# EAGLE design shd_v1.0 (EAGLE 9.3.0)

## Sheet 1 of 2
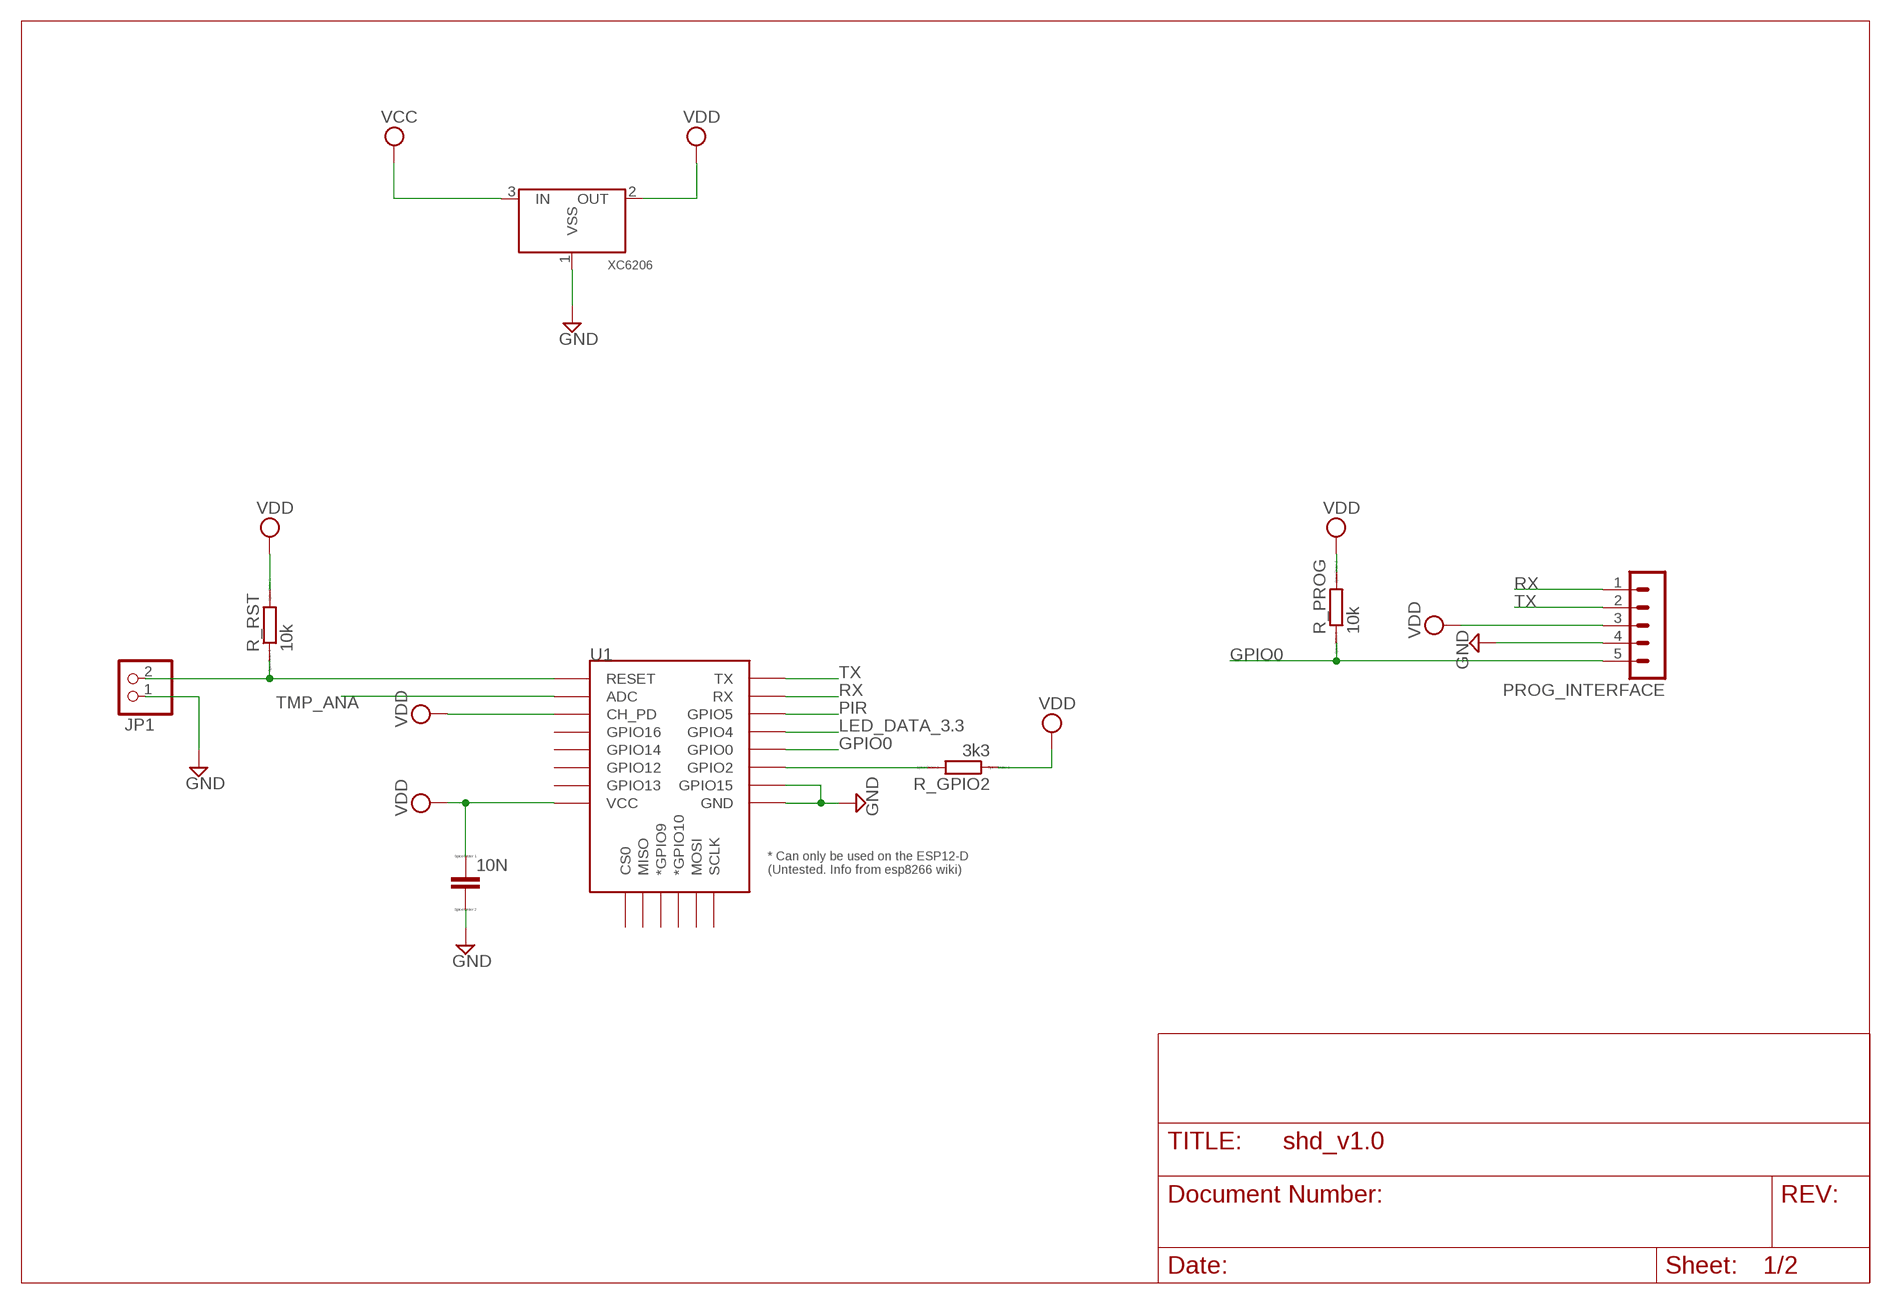
[diagram p0: schematic, sheet 1]

### Parts
10N  C  [C0805]
JP1  PINHD-1X2  [1X02]
PROG_INTERFACE  MA05-1  [MA05-1]
R_GPIO2  3k3  R0207/10  [0207/10]
R_PROG  10k  R0207/10  [0207/10]
R_RST  10k  R0207/10  [0207/10]
U1  ESP12ESMD  [ESP12E-SMD]
XC6206  XC6206  [SOT23]

### Nets
GND: 10N.2 JP1.1 PROG_INTERFACE.4 U1.GND U1.GPIO15 XC6206.1(VSS) ; also sheet 2
GPIO0: PROG_INTERFACE.5 R_PROG.1 U1.GPIO0
LED_DATA_3.3: U1.GPIO4 ; also sheet 2
N$2: R_GPIO2.2 U1.GPIO2
PIR: U1.GPIO5 ; also sheet 2
RST: JP1.2 R_RST.1 U1.RESET
RX: PROG_INTERFACE.1 U1.RXD0(RX)
TMP_ANA: U1.ADC ; also sheet 2
TX: PROG_INTERFACE.2 U1.TXD0(TX)
VCC_5.0: XC6206.3(IN) ; supply symbol labelled VCC ; also sheet 2
VDD: R_GPIO2.1
VDD_3.3: 10N.1 PROG_INTERFACE.3 R_PROG.2 R_RST.2 U1.CH_PD U1.VCC XC6206.2(OUT) ; supply symbol labelled VDD ; also sheet 2
Unconnected: U1.CS0 U1.GPIO9(*GPIO9) U1.GPIO10(*GPIO10) U1.GPIO12 U1.GPIO13 U1.GPIO14 U1.GPIO16 U1.MISO U1.MOSI U1.SCLK

## Sheet 2 of 2
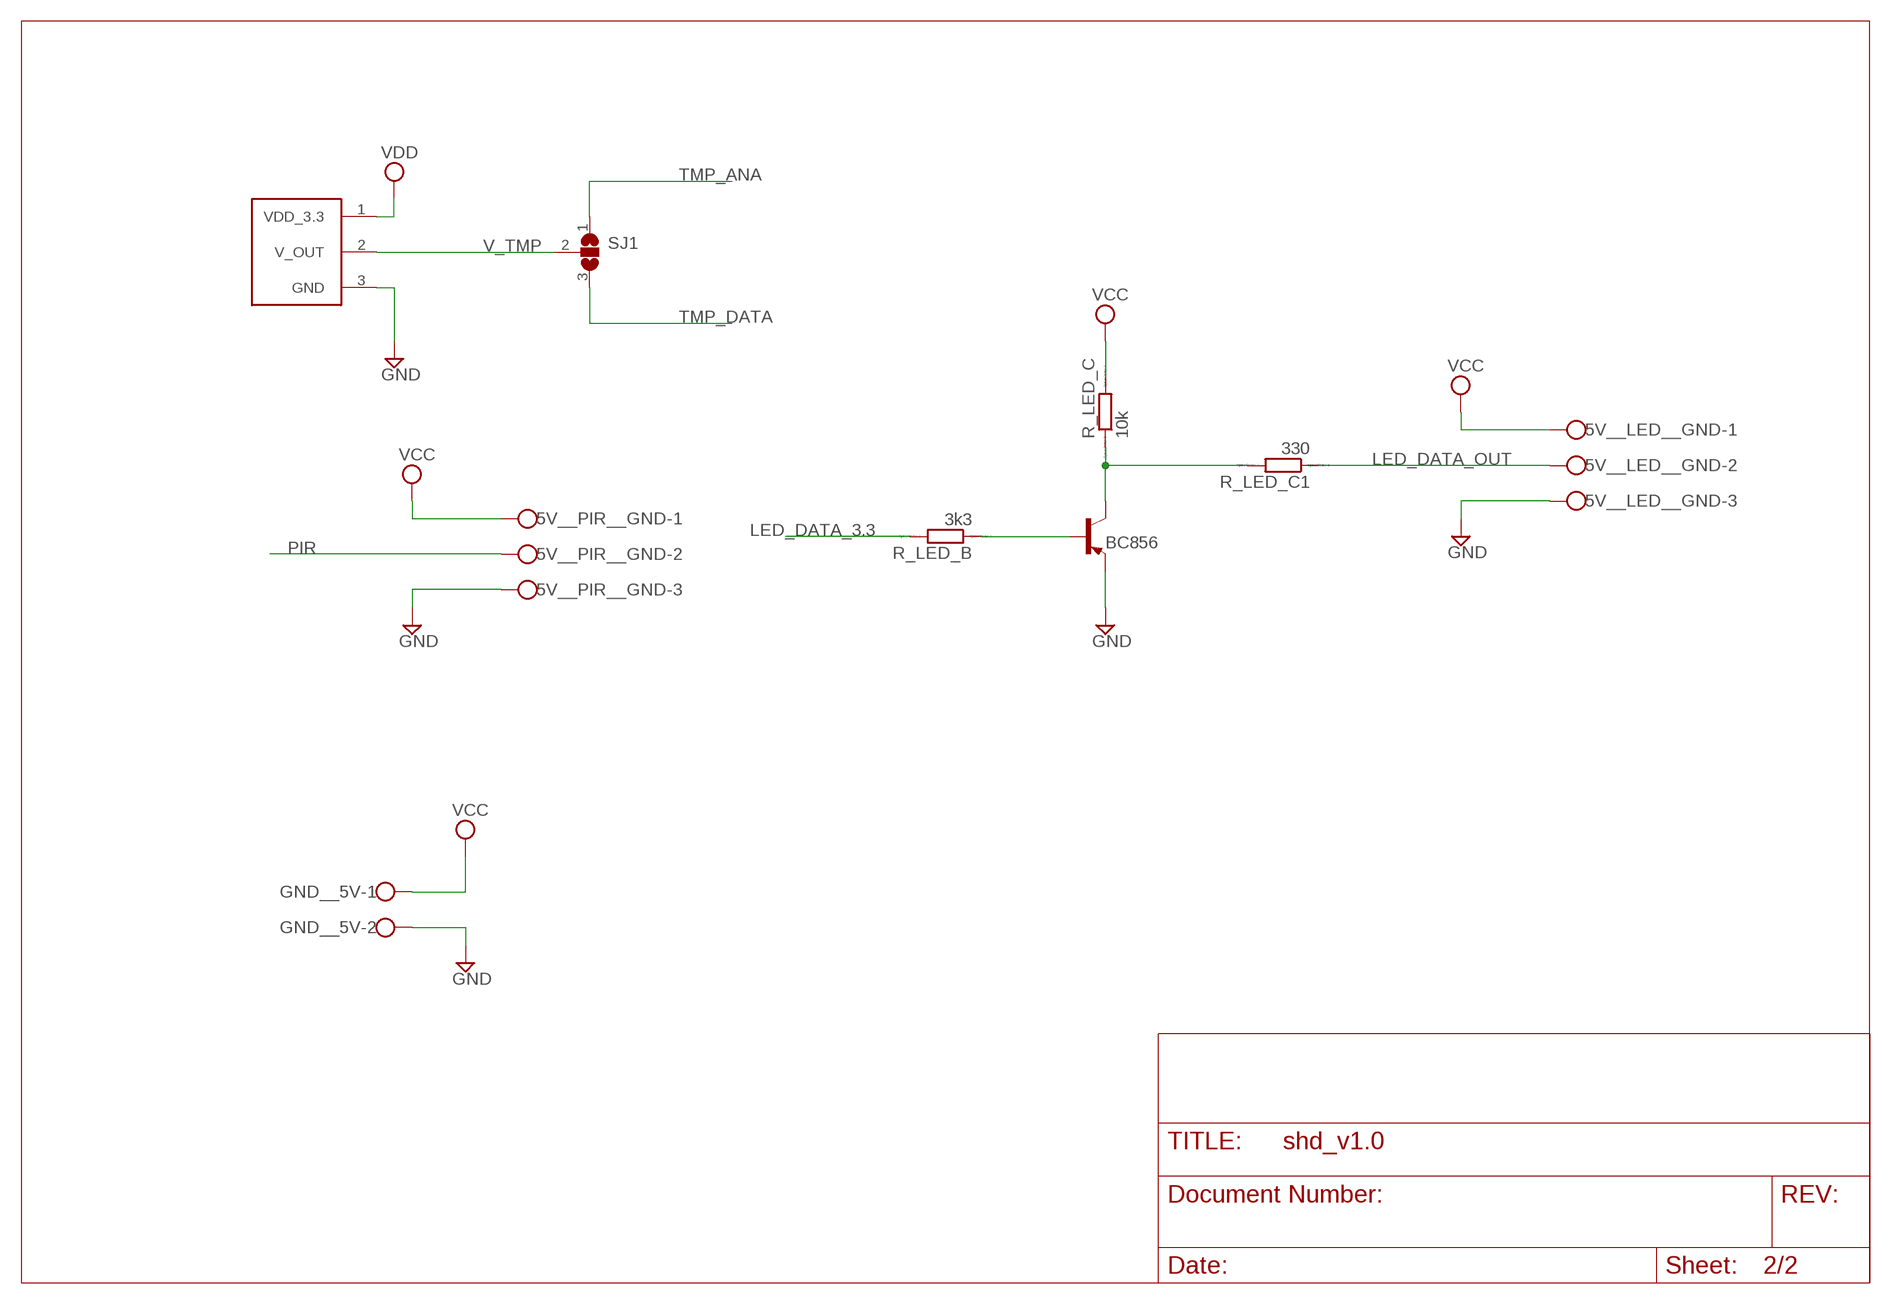
[diagram p1: schematic, sheet 2]

### Parts
5V__LED__GND  W237-103  [W237-103]
5V__PIR__GND  W237-103  [W237-103]
BC856  BC856A-PNP-SOT23-BEC  [SOT23-BEC]
GND__5V  W237-102  [W237-102]
R_LED_B  3k3  R0207/10  [0207/10]
R_LED_C  10k  R0207/10  [0207/10]
R_LED_C1  330  R0207/10  [0207/10]
SJ1  SJ2W  [SJ_2]
TMP36  TMP36  [TO-92]

### Nets
GND: 5V__LED__GND.3 5V__PIR__GND.3 BC856.E GND__5V.2 TMP36.3(GND) ; also sheet 1
LED_DATA_3.3: R_LED_B.2 ; also sheet 1
LED_DATA_3.3_R: BC856.B R_LED_B.1
LED_DATA_5.0: BC856.C R_LED_C1.2 R_LED_C.1
LED_DATA_OUT: 5V__LED__GND.2 R_LED_C1.1
PIR: 5V__PIR__GND.2 ; also sheet 1
TMP_ANA: SJ1.1 ; also sheet 1
TMP_DATA: SJ1.3
V_TMP: SJ1.2 TMP36.2(V_OUT)
VCC_5.0: 5V__LED__GND.1 5V__PIR__GND.1 GND__5V.1 R_LED_C.2 ; supply symbol labelled VCC ; also sheet 1
VDD_3.3: TMP36.1(VDD_3.3) ; supply symbol labelled VDD ; also sheet 1

## Library data of the parts
5V__LED__GND 5V__PIR__GND = con-wago-500:W237-103: WAGO SCREW CLAMP; MPN: 237-103; OC_FARNELL: unknown; OC_NEWARK: 18M7116
10N = eagle-ltspice:C: CAPACITOR, European symbol; SPICEMODEL: NONE; SPICEPREFIX: C
BC856 = transistor:*-PNP-: PNP Transistror
GND__5V = con-wago-500:W237-102: WAGO SCREW CLAMP; MPN: 237-102; OC_FARNELL: unknown; OC_NEWARK: 70K9898
JP1 = pinhead:PINHD-1X2: PIN HEADER
PROG_INTERFACE = con-lstb:MA05-1: PIN HEADER; OC_FARNELL: unknown; OC_NEWARK: unknown
R_GPIO2 R_LED_B R_LED_C R_LED_C1 R_PROG R_RST = eagle-ltspice:R: RESISTOR, European symbol; SPICEMODEL: NONE; SPICEPREFIX: R
SJ1 = jumper:SJ2W: SMD solder JUMPER
TMP36 = tmp36:TMP36
U1 = esp8266modules:ESP12E: ESP12E Module
XC6206 = Voltage Regulator:XC6206: XC6206P , linear regulator. Producted by TOREX.Co Store Information: EXCEL device corporation http://www.excel-d.com/access/index.html

## Board
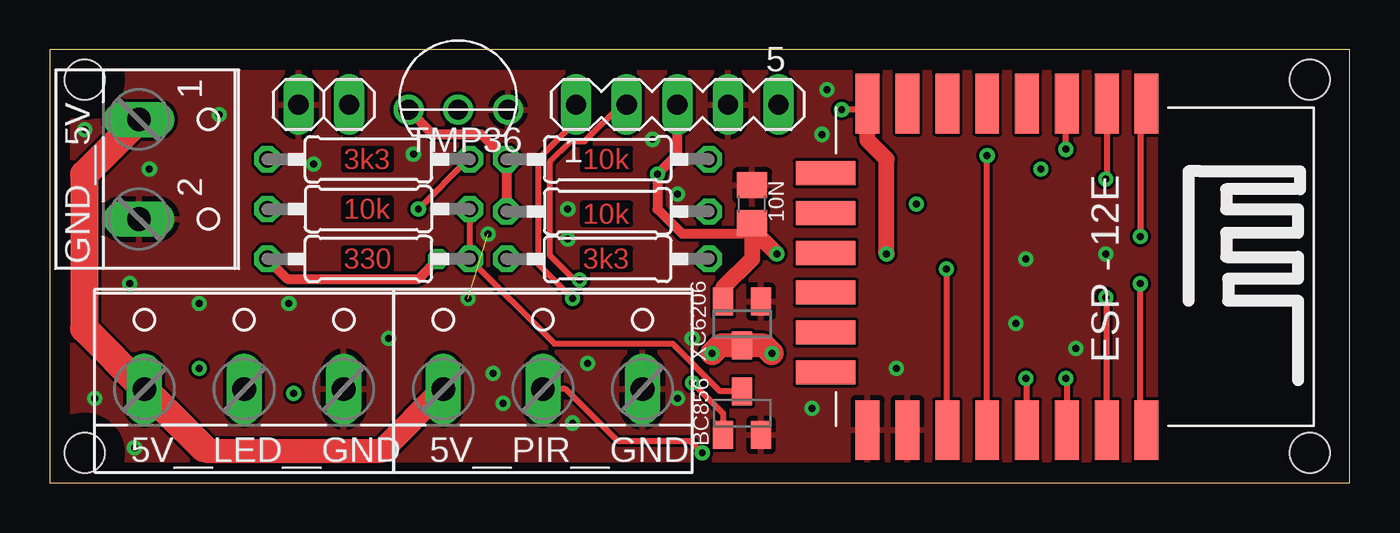
[diagram p2: board, top side]
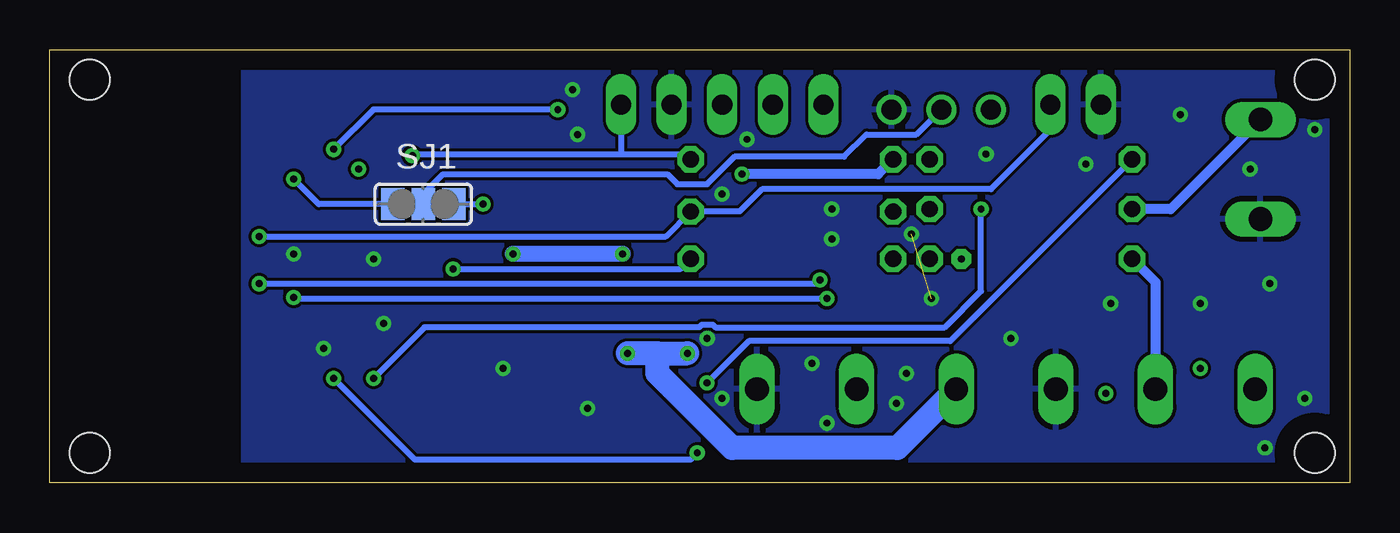
[diagram p3: board, bottom side, seen from below]

Size 65.25 x 21.75 mm. Coordinates in mm from the lower left corner, seen from the top.
Outline: 0,0 65.25,0 65.25,21.75 0,21.75 0,0
Copper layers (1*16): Top 0.035mm / dielectric 1.5mm / Bottom 0.035mm
Design rules "default *": minimum track width 0.3mm, minimum drill 0.35mm, track to track 6mil, track to pad 6mil, pad to pad 6mil, via to via 6mil, smd to smd 6mil, copper to edge 40mil, drill to drill 6mil, minimum pad ring 10mil, minimum via ring 8mil, stop-mask expansion 4mil, vias tented up to drill 0mil, thermal gap 10mil
Holes 2 mm at 1.75,20.25 63.25,20.25 63.25,1.5 1.75,1.5

### Footprints (pad centres in the part's own frame; a part is rotated, then mirrored left to right if it is on the bottom)
W237-103 = drill 1.194 long: 1 -5,-1.29; 2 0,-1.29; 3 5,-1.29
C0805 = smd 1.3 x 1.5: 1 -0.95,0; 2 0.95,0
SOT23-BEC = smd 1 x 1.4: B -0.95,-1.1; C 0,1.1; E 0.95,-1.1
W237-102 = drill 1.194 long: 1 -2.5,-1.27; 2 2.5,-1.27
1X02 = drill 1.016 long: 1 -1.27,0; 2 1.27,0
MA05-1 = drill 1.016 long: 1 -5.08,0; 2 -2.54,0; 3 0,0; 4 2.54,0; 5 5.08,0
0207/10 = drill 0.813 octagon: 1 -5.08,0; 2 5.08,0
SJ_2 = smd 1.168 x 1.6: 1 -1.524,0; 2 0,0; 3 1.524,0
TO-92 = drill 1: 1 -2.5,0; 2 0,0; 3 2.5,0
ESP12E-SMD = smd 3 x 1.2: ADC -8.3,3.8; CH_PD -8.3,1.8; GND 8.1,-8.2; GPIO0 8.1,-2.2; GPIO2 8.1,-4.2; GPIO4 8.1,-0.2; GPIO5 8.1,1.8; GPIO12 -8.3,-4.2; GPIO13 -8.3,-6.2; GPIO14 -8.3,-2.2; GPIO15 8.1,-6.2; GPIO16 -8.3,-0.2; RESET -8.3,5.8; RXD0 8.1,3.8; TXD0 8.1,5.8; VCC -8.3,-8.2 | smd 1.2 x 3: CS0 -4.8,-10.3; GPIO9 -0.8,-10.3; GPIO10 1.2,-10.3; MISO -2.8,-10.3; MOSI 3.2,-10.3; SCLK 5.2,-10.3
SOT23 = smd 1 x 1.4: 1 -0.95,-1.1; 2 0.95,-1.1; 3 0,1.1

### Placement (x,y rotation side)
5V__LED__GND  9.75,6 0 top
5V__PIR__GND  24.75,6 0 top
10N  35.25,14 90 top
BC856  34.75,3.5 0 top
GND__5V  5.75,15.75 270 top
JP1  13.75,19 0 top
PROG_INTERFACE  31.5,19 0 top
R_GPIO2  28,11.25 0 top
R_LED_B  16,16.25 0 top
R_LED_C  16,13.75 180 top
R_LED_C1  16,11.25 0 top
R_PROG  28,16.25 180 top
R_RST  28,13.62 180 top
SJ1  46.5,14 0 bottom
TMP36  20.5,18.75 0 top
U1  49.25,10.75 270 top
XC6206  34.75,8 180 top

### Tracks (layer width: path | path; a pad name or v marks a point on that pad's centre or on a via)
GND  (via drill 0.35)  (1 unrouted)
  other vias: 2.25,4.25 4.25,1.75 7.5,9 4,10 5,15.75 8.5,18.5 12,9 17,7.25 22.25,5.5 22.75,4 27,6 26.25,3 38.25,3.75 42.5,5.75 48.5,8 51.5,6.75 53,11.5 49,11.25 38.75,17.5 39,19.75 26,13.75 13.25,16 26,12.25 21,9.25 18.25,16.5 32.25,7.25 31.5,14.5 1.75,17.75 30.25,17.25 31.5,4.25 22,12.5
  pour Top: -0.75,22.5 -0.75,-1 55.5,-1 55.5,22.5
  pour Bottom: -0.75,22.5 -0.75,-1 55.5,-1 55.5,22.5
GPIO0  (via drill 0.35)
  Top 0.3: U1.GPIO0 v47.05,16.43
  Bottom 0.3: PROG_INTERFACE.5 36.58,16.5 | v47.05,16.43 46.98,16.5 36.58,16.5 | 36.58,16.5 33.33,16.5 R_PROG.1
LED_DATA_3.3  (via drill 0.35)
  Top 0.3: U1.GPIO4 49.05,5.2 v49,5.25 | R_LED_B.2 21,16.25 v18.5,13.75
  Bottom 0.3: v49,5.25 46.44,7.81 32.66,7.81 32.53,7.93 31.97,7.93 31.84,7.81 20.33,7.81 18.5,9.63 v18.5,13.75
LED_DATA_3.3_R  (via drill 0.35)
  Top 0.3: v32.27,5.02 33.8,3.49 BC856.B
  Bottom 0.3: R_LED_B.1 20.05,7.12 30.16,7.12 v32.27,5.02
LED_DATA_5.0
  Top 0.3: R_LED_C.1 R_LED_C1.2 25.33,7 31.25,7 33.65,4.6 BC856.C
LED_DATA_OUT  (via drill 0.35 pad 1)
  Top 0.5: R_LED_C1.1 11.92,10.25 18.5,10.25 v19.5,11.25
  Bottom 0.5: R_LED_C1.1 9.75,10.08 5V__LED__GND.2
N$2  (via drill 0.35)
  Top 0.3: U1.GPIO2 45,2.7 v45,10.75
  Bottom 0.3: v45,10.75 33.58,10.75 R_GPIO2.2
N$3  (via drill 0.35)
  other vias: 49.75,15.75
N$4  (via drill 0.35)
  other vias: 12.25,4.5
N$5  (via drill 0.35)
  other vias: 7.5,5.75
PIR  (via drill 0.35)
  Top 0.3: v51,5.25 51.05,5.2 U1.GPIO5 | v32.75,1.5 32.15,2.1 28.5,2.1 25.89,4.71 5V__PIR__GND.2
  Bottom 0.3: v32.75,1.5 33.08,1.17 46.92,1.17 v51,5.25
RST  (via drill 0.35)
  Top 0.3: U1.RESET 54.75,18.75 v54.75,12.38
  Bottom 0.3: v54.75,12.38 34.33,12.38 R_RST.1 30.62,13.62 29.5,14.75 18,14.75 15.02,17.73 JP1.2
RX  (via drill 0.35)
  Top 0.3: U1.RXD0 53.05,9.27 v53,9.32 | PROG_INTERFACE.1 26.42,18.17 24.5,16.25 24.5,11 v26.25,9.25
  Bottom 0.3: v26.25,9.25 52.93,9.25 v53,9.32
TMP_ANA  (via drill 0.35)
  Top 0.3: 53,19 U1.ADC 53.05,15.3 v53,15.25
  Bottom 0.3: SJ1.1 51.75,14 v53,15.25
TMP_DATA  (via drill 0.35)
  Bottom 0.3: SJ1.3 v43.5,14
TX  (via drill 0.35)
  Top 0.3: v26.6,10.19 26.35,10.19 25.12,11.41 25.12,16.12 26.16,17.16 26.84,17.16 28.69,19 PROG_INTERFACE.2 | U1.TXD0 54.75,2.95 v54.75,10
  Bottom 0.3: v26.6,10.19 26.6,10 v54.75,10
V_TMP
  Bottom 0.3: TMP36.2 21.75,17.5 24.25,17.5 25.38,16.38 30.88,16.38 32.25,15 33.75,15 34.25,15.5 45.5,15.5 46.5,14.5 SJ1.2
VCC_5.0  (via drill 0.35)
  Top 1.2: 7.71,1.75 7.84,1.62 16.66,1.62 5V__PIR__GND.1 | v36.25,6.5 35.85,6.9 XC6206.3 33.65,6.9 v33.25,6.5
  Top 1.4: GND__5V.1 1.72,15.49 1.72,7.74 5V__LED__GND.1 7.71,1.75
  Bottom 0.5: GND__5V.1 8.98,13.75 R_LED_C.2
  Bottom 1.2: 5V__PIR__GND.1 22.71,1.75 31,1.75 34.75,5.5 34.75,6.5 | 34.75,6.5 v36.25,6.5 | 34.75,6.5 v33.25,6.5
VDD_3.3  (via drill 0.35)
  Top 0.3: v51,16.75 51,19 U1.CH_PD | U1.VCC 40.75,18.75 v39.75,18.75
  Top 0.5: U1.VCC 41.05,19.95 | R_RST.2 R_PROG.2 21.67,17.5 19.25,17.5 TMP36.1 | 10N.1 34.7,12.5 31.75,12.5 30.5,13.75 v30.5,15.5 31.5,16.5 PROG_INTERFACE.3
  Top 0.8: XC6206.2 33.8,9.8 35.25,11.25 10N.1 35.25,12.75 v36.5,11.5 | v42,11.5 42,16.25 41.05,17.2 U1.VCC
  Bottom 0.3: 50.75,17 v51,16.75 49,18.75 v39.75,18.75
  Bottom 0.5: R_PROG.2 23.67,15.5 v30.5,15.5
  Bottom 0.8: v36.5,11.5 v42,11.5

### Text on the board
Top: 3k3 | 10k | 10k | 10k | 330 | 3k3